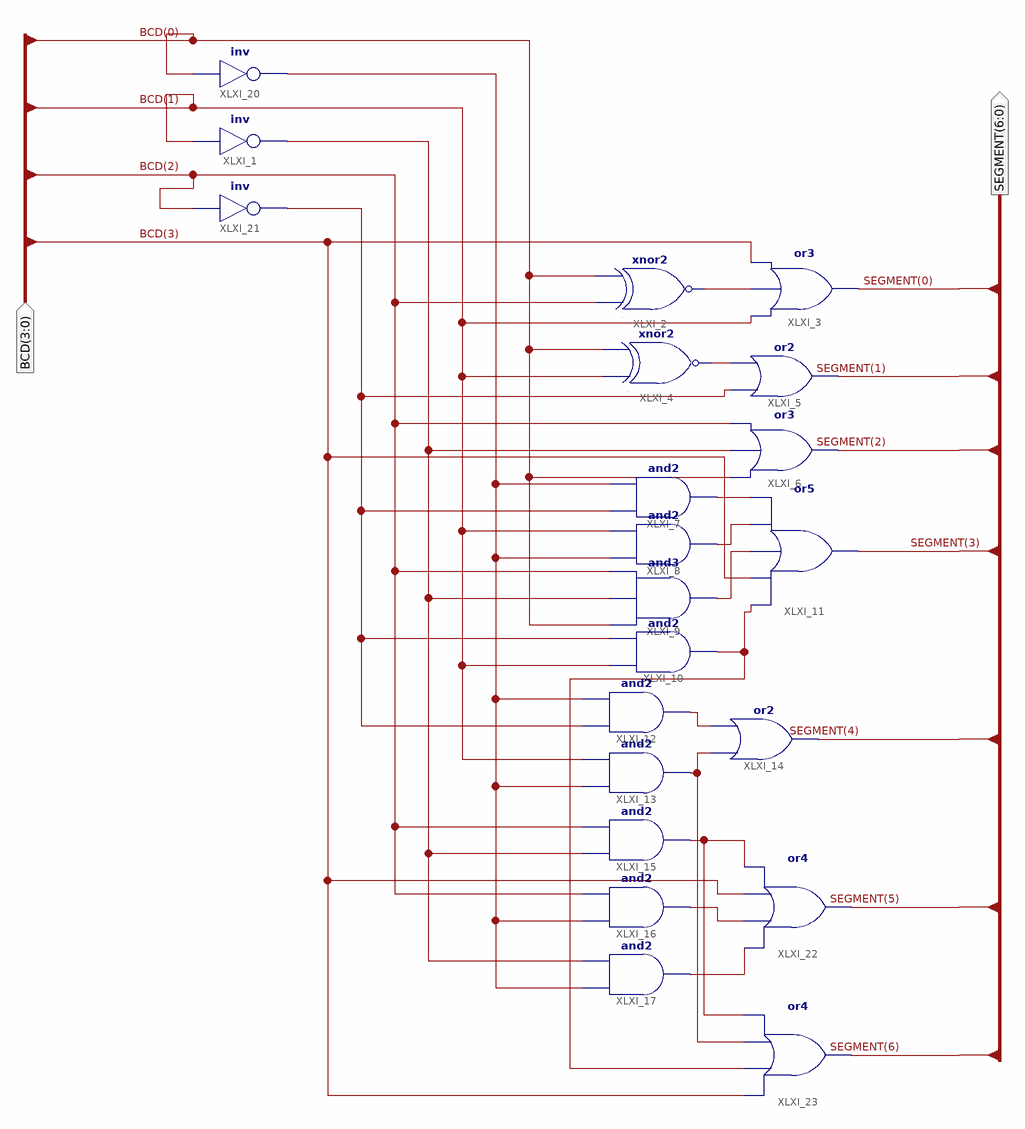
[diagram p0: schematic sheet 1]
// Xilinx ISE schematic BCDto7Seg.sch (spartan6) as structural Verilog: 21 symbols, 2 ports
module BCDto7Seg (
  input  [3:0] BCD,
  output [6:0] SEGMENT
);

  wire XLXN_1, XLXN_2, XLXN_3, XLXN_4, XLXN_5, XLXN_7, XLXN_8, XLXN_9, XLXN_10, XLXN_14, XLXN_15, XLXN_22,
       XLXN_32, XLXN_33;

  not XLXI_1 (XLXN_15, BCD[1]);
  xnor XLXI_2 (XLXN_1, BCD[2], BCD[0]);
  or XLXI_3 (SEGMENT[0], BCD[1], XLXN_1, BCD[3]);
  xnor XLXI_4 (XLXN_2, BCD[1], BCD[0]);
  or XLXI_5 (SEGMENT[1], XLXN_22, XLXN_2);
  or XLXI_6 (SEGMENT[2], BCD[0], XLXN_15, BCD[2]);
  and XLXI_7 (XLXN_3, XLXN_22, XLXN_14);
  and XLXI_8 (XLXN_4, XLXN_14, BCD[1]);
  and XLXI_9 (XLXN_5, BCD[0], XLXN_15, BCD[2]);
  and XLXI_10 (XLXN_7, BCD[1], XLXN_22);
  or XLXI_11 (SEGMENT[3], XLXN_7, BCD[3], XLXN_5, XLXN_4, XLXN_3);
  and XLXI_12 (XLXN_8, XLXN_22, XLXN_14);
  and XLXI_13 (XLXN_9, XLXN_14, BCD[1]);
  or XLXI_14 (SEGMENT[4], XLXN_9, XLXN_8);
  and XLXI_15 (XLXN_10, XLXN_15, BCD[2]);
  and XLXI_16 (XLXN_33, XLXN_14, BCD[2]);
  and XLXI_17 (XLXN_32, XLXN_14, XLXN_15);
  or XLXI_22 (SEGMENT[5], XLXN_32, XLXN_33, BCD[3], XLXN_10);
  or XLXI_23 (SEGMENT[6], BCD[3], XLXN_7, XLXN_9, XLXN_10);
  not XLXI_20 (XLXN_14, BCD[0]);
  not XLXI_21 (XLXN_22, BCD[2]);
endmodule
